# Altium schematic sheet MCU_H7.SchDoc
size A4; SheetNumber: 4; SheetTotal: 6
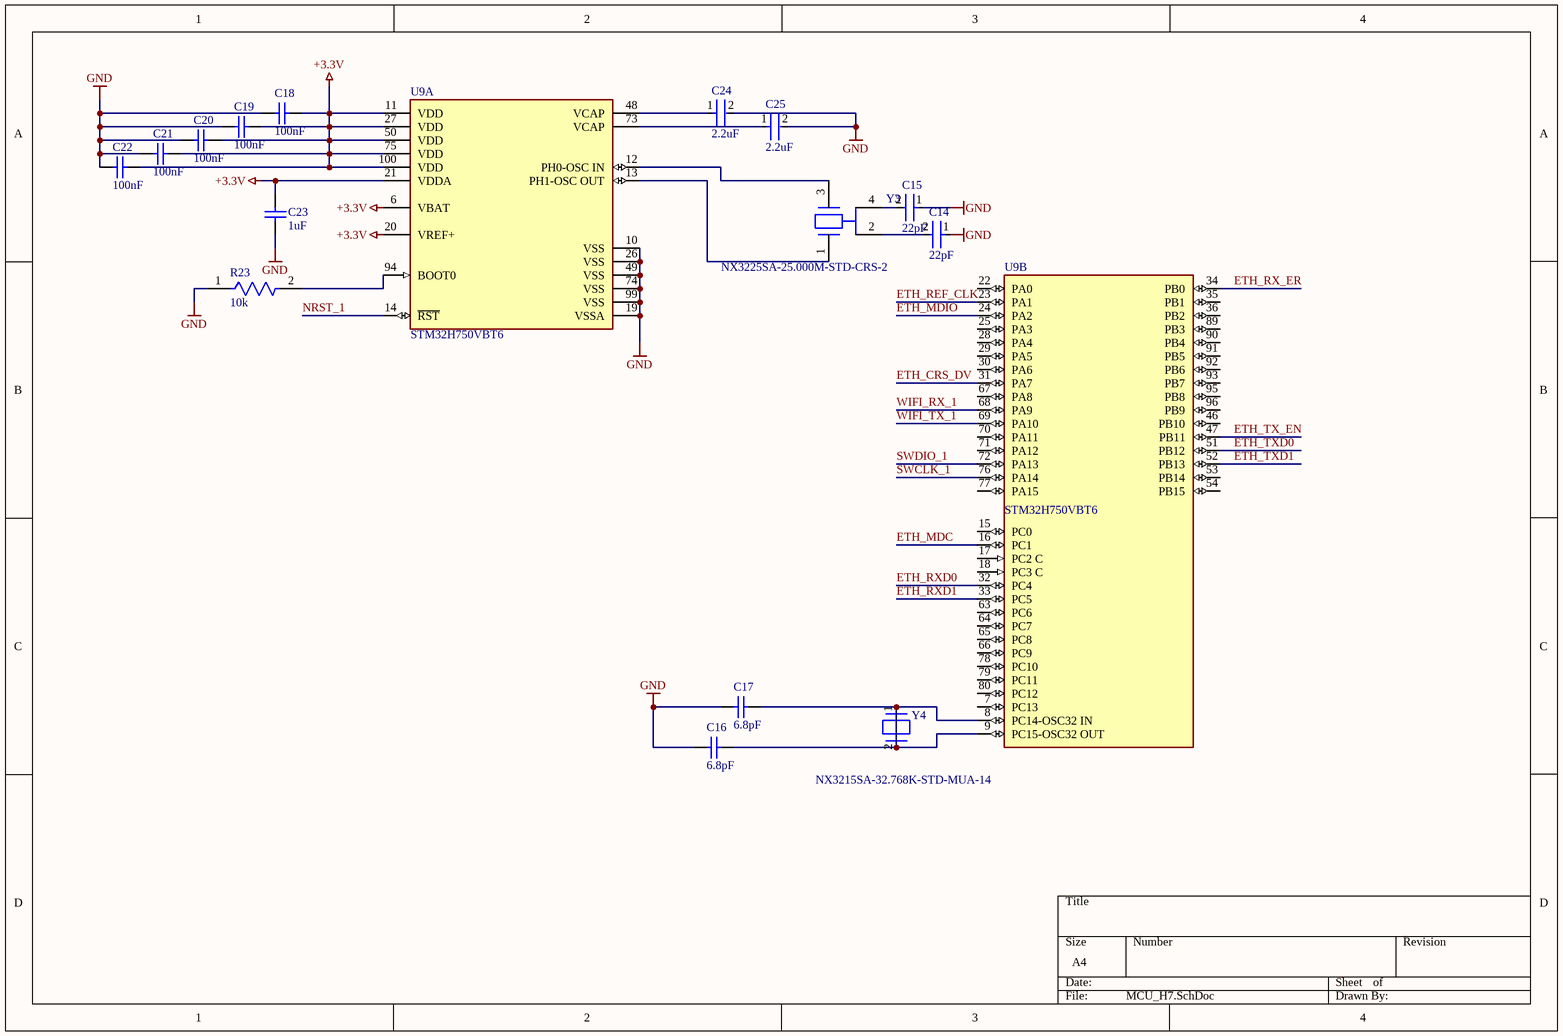
[diagram p0: MCU_H7.SchDoc]

## Parts
C14  22pF  [FP-C0805C-DN-MFG]
C15  22pF  [FP-C0805C-DN-MFG]
C16  6.8pF  [CAPC2013X94X50NL20T25]
C17  6.8pF  [CAPC2013X94X50NL20T25]
C18  100nF  [CAPC2013X140X50ML20T25]
C19  100nF  [CAPC2013X140X50ML20T25]
C20  100nF  [CAPC2013X140X50ML20T25]
C21  100nF  [CAPC2013X140X50ML20T25]
C22  100nF  [CAPC2013X140X50ML20T25]
C23  1uF  [CAPC2013X145X50NL20T20]
C24  2.2uF  [FP-CC0805-0_85-MFG]
C25  2.2uF  [FP-CC0805-0_85-MFG]
R23  10k  [FP-CRGP0805-IPC_C]
U9  STM32H750VBT6  [FP-LQFP100-1L-MFG]  (parts A,B of 3)
Y3  NX3225SA-25.000M-STD-CRS-2  [FP-NX3225SA-MFG]
Y4  NX3215SA-32.768K-STD-MUA-14  [FP-NX3215SA-MFG]

## Nets
+3.3V: C18.2 C19.2 C20.2 C21.2 C22.2 C23.2 U9.6(VBAT) U9.11(VDD) U9.20(VREF+) U9.21(VDDA) U9.27(VDD) U9.50(VDD) U9.75(VDD) U9.100(VDD)
GND: C14.1 C15.1 C16.1 C17.2 C18.1 C19.1 C20.1 C21.1 C22.1 C23.1 C24.2 C25.2 R23.1 U9.10(VSS) U9.19(VSSA) U9.26(VSS) U9.49(VSS) U9.74(VSS) U9.99(VSS)
ETH_CRS_DV: U9.31(PA7)
ETH_MDC: U9.16(PC1)
ETH_MDIO: U9.24(PA2)
ETH_REF_CLK: U9.23(PA1)
ETH_RX_ER: U9.34(PB0)
ETH_RXD0: U9.32(PC4)
ETH_RXD1: U9.33(PC5)
ETH_TX_EN: U9.47(PB11)
ETH_TXD0: U9.51(PB12)
ETH_TXD1: U9.52(PB13)
NRST_1: U9.14(~{RST})
SWCLK_1: U9.76(PA14)
SWDIO_1: U9.72(PA13)
WIFI_RX_1: U9.68(PA9)
WIFI_TX_1: U9.69(PA10)
NetC14_2: C14.2 Y3.2(GND)
NetC15_2: C15.2 Y3.4(GND)
NetC16_2: C16.2 C17.1 U9.8(PC14-OSC32_IN) U9.9(PC15-OSC32_OUT) Y4.1 Y4.2
NetC24_1: C24.1 U9.48(VCAP)
NetC25_1: C25.1 U9.73(VCAP)
NetR23_2: R23.2 U9.94(BOOT0)
NetU9_12: U9.12(PH0-OSC_IN) Y3.3
NetU9_13: U9.13(PH1-OSC_OUT) Y3.1

Not connected (* = marked no-connect by the designer): U9 7(PC13) 15(PC0) 17(PC2_C) 18(PC3_C) 22(PA0) 25(PA3) 28(PA4) 29(PA5) 30(PA6) 35(PB1) 36(PB2) 46(PB10) 53(PB14) 54(PB15) 63(PC6) 64(PC7) 65(PC8) 66(PC9) 67(PA8) 70(PA11) 71(PA12) 77(PA15) 78(PC10) 79(PC11) 80(PC12) 89(PB3) 90(PB4) 91(PB5) 92(PB6) 93(PB7) 95(PB8) 96(PB9)

## Library data of the parts
C14 C15 = CMP-2007-00314-2: CAP CER 22PF 100V 10% NP0 0805; Manufacturer Part Number: C0805C220K1GACTU; Manufacturer: KEMET; Temperature Characteristic: C0G; Tolerance: 0.1; Material: Ceramic; Temperature Coefficient: 30ppm/°C; ComponentLink2Description: Datasheet; Digikey Description: CAP CER 22PF 100V 10% NP0 0805; Value: 22 pF; Temperature Range High: +125°C; Package: C0805C-DN; Voltage Rating: 100 V; Octopart: https://octopart.com/c0805c220k1gactu-kemet-9138624; Capacitance: 22 pF; Lead Free: Yes; Temperature: -55°C to +125°C; Category: Cap; Device Class L3: Ceramic Capacitors; ComponentLink2URL: https://content.kemet.com/datasheets/KEM_C1003_C0G_SMD.pdf; Ipc Land Pattern Name: CAPC200125X78; Automotive: No; Mouser Description: Cap Ceramic 22pF 100V C0G 10% SMD 0805 125°C Plastic T/R; RoHS: TRUE; Height: 0.88mm; Device Class L1: Passive Components; Temperature Range Low: -55°C; Device Class L2: Capacitors
C16 C17 = CMP-2007-04154-1: Part Number: 08051A6R8DAT2A; Manufacturer: AVX Interconnect / Elco
C18-C22 = CMP-2007-04651-1: Part Number: 0805DD104KAT2A; Manufacturer: AVX Interconnect / Elco
C23 = CMP-2007-01676-1: Part Number: VJ0805Y105KXQRW1BC; Manufacturer: Vitramon
C24 C25 = CMP-03422-000272-1: CAP CER 2.2UF 10V X7R 0805; Manufacturer Part Number: CC0805MKX7R6BB225; Manufacturer: Yageo; Tolerance: 0.2; Material: Ceramic; Octopart: https://octopart.com/cc0805mkx7r6bb225-yageo-81932646; Package: CC0805-0.85; Digikey Description: CAP CER 2.2UF 10V X7R 0805; Device Class L1: Passive Components; Value: 2.2 uF; Temperature: -30°C to +85°C; Footprint Url: http://www.yageo.com/exep/pages/download/literatures/UPY-C_GEN_24.pdf; Capacitance: 2.2 uF; Lead Free: Yes; Automotive: No; Temperature Characteristic: X7R; Voltage Rating: 10 V; Ipc Land Pattern Name: CAPC200125X85; ComponentLink2Description: Datasheet; Height: 0.95mm; Device Class L3: Ceramic Capacitors; ComponentLink2URL: http://www.yageo.com/documents/recent/UPY-GPHC_Y5V_6.3V-to-50V_8.pdf; Category: Cap; Temperature Range Low: -30°C; Temperature Range High: +85°C; RoHS: TRUE; Device Class L2: Capacitors
R23 = CMP-03211-006861-1: CRGP 0805 10K 1%; Manufacturer Part Number: CRGP0805F10K; Manufacturer: TE; Power Rating: 0.33W; Voltage Rating: 150V; Value: 10KΩ; Tolerance: 0.01; Temperature Coefficient: ±100ppm/°C; ComponentLink2URL: https://www.mouser.com/datasheet/2/418/NG_DS_9-1773463-9_A-1358566.pdf; Temperature Range Low: -55°C; Ipc Land Pattern Name: RESC200125X55; Device Class L2: Resistors; Automotive: No; Device Class L3: Chip SMD Resistors; Composition: Thick Film; Temperature Range High: +155°C; Temperature: -55°C to +155°C; Height: 0.65mm; Series: CRGP; RoHS: TRUE; Device Class L1: Passive Components; Octopart: https://octopart.com/crgp0805f10k-te+connectivity-91018782; Package: CRGP0805; Digikey Description: CRGP 0805 10K 1%; Ambient Temperature Range High: +70°C; Lead Free: Yes; ComponentLink2Description: Datasheet; Category: Res; Resistance: 10KΩ
U9 = CMP-12105-000017-1: IC MCU 32BIT 128KB FLASH 100LQFP; Manufacturer: STMicroelectronics; Number Of Uart Channels: 9; Number Of I/Os: 82; Max Junction Temp: +125°C; Data Bus Width: 32bits; Ram Size: 1MBytes; Min Supply Voltage: 1.62V; Number Of Spi Channels: 6; Number Of Adc Channels: 36; Max Supply Voltage: 3.6V; Standoff Height: 0.05mm; Interface: I2C,SPI,UART,USART,CAN,USB,LIN,IrDA,Ethernet,I2S,Other; Number Of A/D Converters: 3; Number Of I2C Channels: 4; Memory Size: 128KBytes; Frequency: 480MHz; Number Of Timers/Counters: 20; Number Of Ethernet Channels: 1; Core Architecture: ARM Cortex-M7; Number Of Usb Channels: 2; Number Of Pwm Channels: 42; Ambient Temperature Range High: +85°C; Temperature: -40°C to +125°C; ComponentLink2URL: https://www.st.com/resource/en/datasheet/stm32h750vb.pdf; Device Class L2: Embedded Processors and Controllers; Temperature Range Low: -40°C; Octopart: https://octopart.com/stm32h750vbt6-stmicroelectronics-94048547; Category: IC; Manufacturer Part Number: STM32H750VBT6; Height: 1.6mm; Lead Free: Yes; Device Class L1: Integrated Circuits (ICs); Digikey Description: IC MCU 32BIT 128KB FLASH 100LQFP; RoHS: TRUE; Ambient Temperature Range Low: -40°C; Device Class L3: Microcontrollers; ComponentLink2Description: Datasheet; Mouser Description: MCU 32-Bit STM32H750VB ARM Cortex M7 RISC 128KB Flash 1.8V/2.5V/3.3V 100-Pin LQFP Tray; Number Of Cores: 1; Automotive: No; Memory Type: FLASH; Package: LQFP100-1L; Temperature Range High: +125°C
Y3 = CMP-200220-000002-1: CRYSTAL 25.0000MHZ 8PF SMD; Manufacturer: NDK; Frequency: 25MHz; Automotive Grade: Grade 1; Esr: 100Ω; Tolerance: 15ppm; Digikey Description: CRYSTAL 25.0000MHZ 8PF SMD; Temperature Range Low: -40°C; Octopart: https://octopart.com/nx3225sa-25.000m-std-crs-2-ndk-51374293; Series: NX3225SA; Manufacturer Part Number: NX3225SA-25.000M-STD-CRS-2; ComponentLink2URL: https://www.ndk.com/images/products/catalog/c_NX3225SA-STD-CRS-2_e.pdf; Lead Free: Yes; Device Class L2: Crystals / Oscillators; ComponentLink2Description: Datasheet; Device Class L3: Crystals; Category: Crys; Device Class L1: Passive Components; Automotive: Yes; RoHS: TRUE; Load Capacitance: 8pF; Height: 0.6mm; Temperature Range High: +125°C; Package: NX3225SA; Temperature: -40°C to +125°C
Y4 = CMP-00536-22488149-1: NX3215SA-32.768K-STD-MUA-14 Parallel - Fundamental Quartz Crystal, 0.032768MHz Nom; ESR (Equivalent Series Resistance): 70kΩ; Frequency Tolerance: 0.002%; Load Capacitance: 6pF; Frequency: 32.768kHz; Width: 1.4986mm; Length: 3.2004mm; RoHS: Compliant; Case/Package: SMD/SMT; Mount: Surface Mount; Height: 889µm; Number of Pins: 2; Packaging: Tape & Reel (TR); Max Operating Temperature: 85°C; NexarPartId: 22488149; Min Operating Temperature: -40°C